# Altium project PCB_Project1.PrjPCB
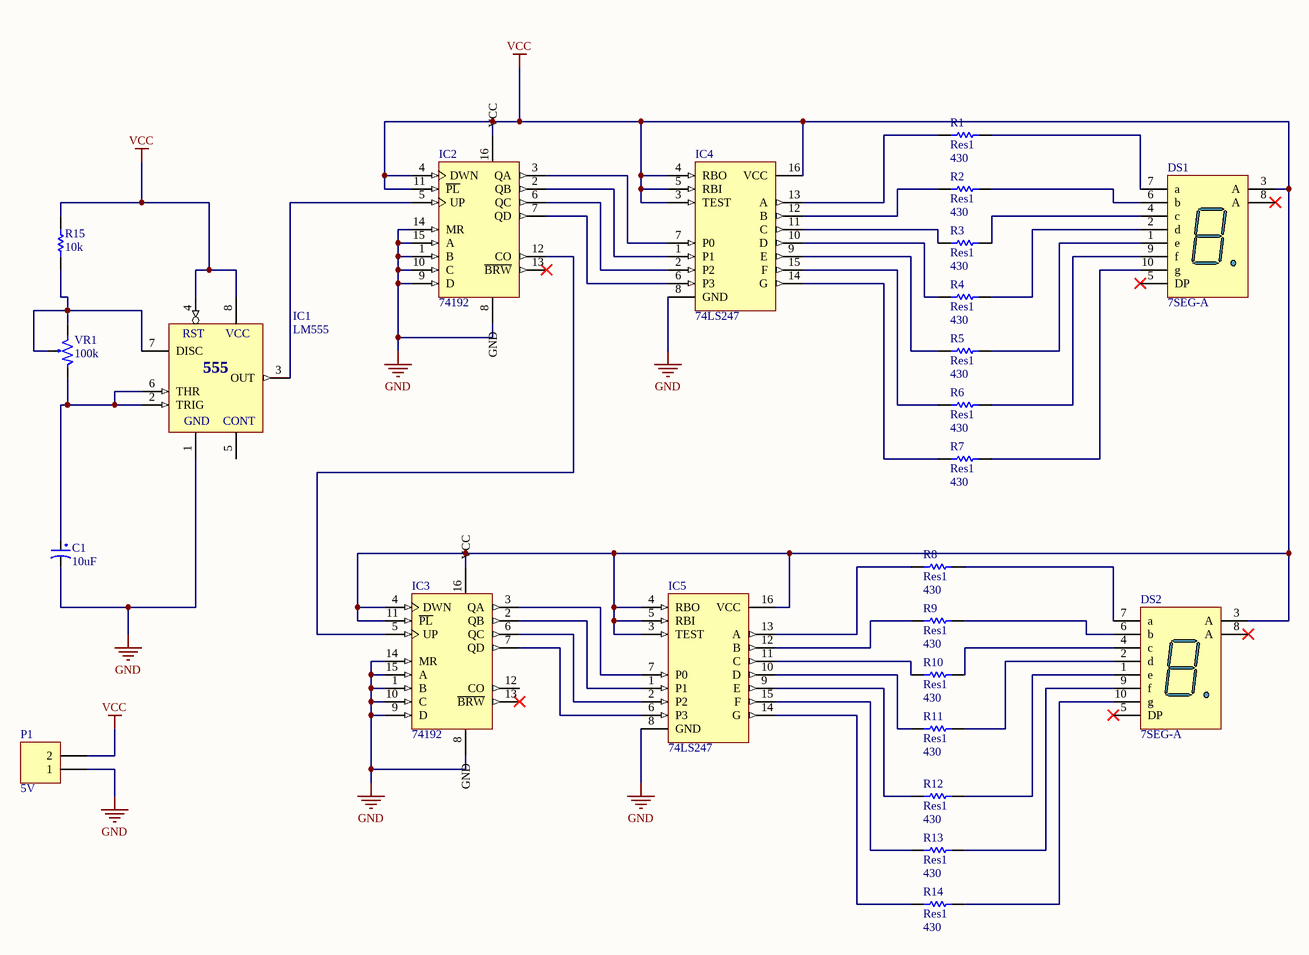
[diagram p0: bai1.SchDoc]
1 sheet, 25 parts. Net scope: global (net labels, ports and power ports of the same name join across sheets).
Board file: PCB1.PcbDoc

## Sheet bai1.SchDoc
size A3

### Parts
C1  10uF  [CP1/2]
DS1  7SEG-A  [LED7SEG]
DS2  7SEG-A  [LED7SEG]
IC1  LM555  [DIP8/W0.3]
IC2  74192  [DIP16/W0.3]
IC3  74192  [DIP16/W0.3]
IC4  74LS247  [DIP16]
IC5  74LS247  [DIP16]
P1  5V  [HDR1X2]
R1  Res1  value 430  [AXIAL-0.3]
R2  Res1  value 430  [AXIAL-0.3]
R3  Res1  value 430  [AXIAL-0.3]
R4  Res1  value 430  [AXIAL-0.3]
R5  Res1  value 430  [AXIAL-0.3]
R6  Res1  value 430  [AXIAL-0.3]
R7  Res1  value 430  [AXIAL-0.3]
R8  Res1  value 430  [AXIAL-0.3]
R9  Res1  value 430  [AXIAL-0.3]
R10  Res1  value 430  [AXIAL-0.3]
R11  Res1  value 430  [AXIAL-0.3]
R12  Res1  value 430  [AXIAL-0.3]
R13  Res1  value 430  [AXIAL-0.3]
R14  Res1  value 430  [AXIAL-0.3]
R15  value 10k  [R1/4W]  (hidden comment: Res1)
VR1  100k  [VR]

### Nets
GND: C1.2 IC1.1(GND) IC2.1(B) IC2.9(D) IC2.10(C) IC2.14(MR) IC2.15(A) IC3.1(B) IC3.9(D) IC3.10(C) IC3.14(MR) IC3.15(A) IC4.8(GND) IC5.8(GND) P1.1
VCC: DS1.3(A) DS2.3(A) IC1.4(RST) IC1.8(VCC) IC2.4(DWN) IC2.11(~{PL}) IC3.4(DWN) IC3.11(~{PL}) IC4.3(TEST) IC4.4(RBO) IC4.5(RBI) IC4.16(VCC) IC5.3(TEST) IC5.4(RBO) IC5.5(RBI) IC5.16(VCC) P1.2 R15.2
NetC1_1: C1.1 IC1.2(TRIG) IC1.6(THR) VR1.1
NetDS1_1: DS1.1(e) R5.2
NetDS1_2: DS1.2(d) R4.2
NetDS1_4: DS1.4(c) R3.2
NetDS1_6: DS1.6(b) R2.2
NetDS1_7: DS1.7(a) R1.2
NetDS1_9: DS1.9(f) R6.2
NetDS1_10: DS1.10(g) R7.2
NetDS2_1: DS2.1(e) R12.2
NetDS2_2: DS2.2(d) R11.2
NetDS2_4: DS2.4(c) R10.2
NetDS2_6: DS2.6(b) R9.2
NetDS2_7: DS2.7(a) R8.2
NetDS2_9: DS2.9(f) R13.2
NetDS2_10: DS2.10(g) R14.2
NetIC1_3: IC1.3(OUT) IC2.5(UP)
NetIC1_7: IC1.7(DISC) R15.1 VR1.2 VR1.3
NetIC2_2: IC2.2(QB) IC4.1(P1)
NetIC2_3: IC2.3(QA) IC4.7(P0)
NetIC2_6: IC2.6(QC) IC4.2(P2)
NetIC2_7: IC2.7(QD) IC4.6(P3)
NetIC2_12: IC2.12(CO) IC3.5(UP)
NetIC3_2: IC3.2(QB) IC5.1(P1)
NetIC3_3: IC3.3(QA) IC5.7(P0)
NetIC3_6: IC3.6(QC) IC5.2(P2)
NetIC3_7: IC3.7(QD) IC5.6(P3)
NetIC4_9: IC4.9(E) R5.1
NetIC4_10: IC4.10(D) R4.1
NetIC4_11: IC4.11(C) R3.1
NetIC4_12: IC4.12(B) R2.1
NetIC4_13: IC4.13(A) R1.1
NetIC4_14: IC4.14(G) R7.1
NetIC4_15: IC4.15(F) R6.1
NetIC5_9: IC5.9(E) R12.1
NetIC5_10: IC5.10(D) R11.1
NetIC5_11: IC5.11(C) R10.1
NetIC5_12: IC5.12(B) R9.1
NetIC5_13: IC5.13(A) R8.1
NetIC5_14: IC5.14(G) R14.1
NetIC5_15: IC5.15(F) R13.1

Not connected (* = marked no-connect by the designer): DS1 5(DP)* 8(A)*; DS2 5(DP)* 8(A)*; IC1 5(CONT); IC2 8(GND) 13(~{BRW})* 16(VCC); IC3 8(GND) 12(CO) 13(~{BRW})* 16(VCC)

### Notes on the sheet
- (in symbol LM555) 555

### Library data of the parts
C1 = CP1: Cap P  0,1uF < 22uF , 16 - 50V; Value: 10uF/50V; Description 1: 10 => 220uF/6,3V/10V - 10uF => 100uF/16V; Description 2: 0,1uF => 33uF/50V - 10uF => 22uF/63V; Description 3: 0,47uF => 10uF/100V
DS1 DS2 = LED7SEG-A: 14.2 mm General Purpose Blue 7-Segment Display: CA, RH DP, Gray Surface; MinimumIntensity: 2020 ucd; Note: IF = 10 mA; Published: 8-Jun-2000; LatestRevisionDate: 17-Dec-2003; LatestRevisionNote: Schematic revised, PCB Footprint replaced.; DatasheetDocument: 24-Sep-2002; PackageDocument: 24-Sep-2002; PackageReference: H; Publisher: Altium Limited; Colour: Blue; ComponentLink1Description: Manufacturer Link; ComponentLink1URL: http://www.agilent.com/
IC1 = LM555: Timer; Value: LM555
IC2 IC3 = 74193: Synchronous 4-Bit Up/Down Counter; Value: 74193; Copyright by: VanDungEvn@Gmail.com
IC4 IC5 = 74247: Value: 74LS238; Copyright by: VanDungEvn@Gmail.com
P1 = Header 2: Header, 2-Pin; LatestRevisionDate: 17-Jul-2002; LatestRevisionNote: Re-released for DXP Platform.; Publisher: Altium Limited
R1-R14 = Res1: Resistor; Published: 8-Jun-2000; LatestRevisionDate: 17-Jul-2002; LatestRevisionNote: Re-released for DXP Platform.; PackageReference: AXIAL-0.3; Publisher: Altium Limited; PackageDescription: Axial Device, Thru-Hole; 2 Leads; 0.3 in Pin Spacing
R15 = Res1_1: Resistor; Manufacturer: Generic Components; Class: Passive; Published: 08/06/2000; Publisher: Altium Hobart Technology Centre; SubClass: Resistor
VR1 = VR1: Var Resistor; Value: VR 10K